# EAGLE design main (EAGLE 9.0.1)
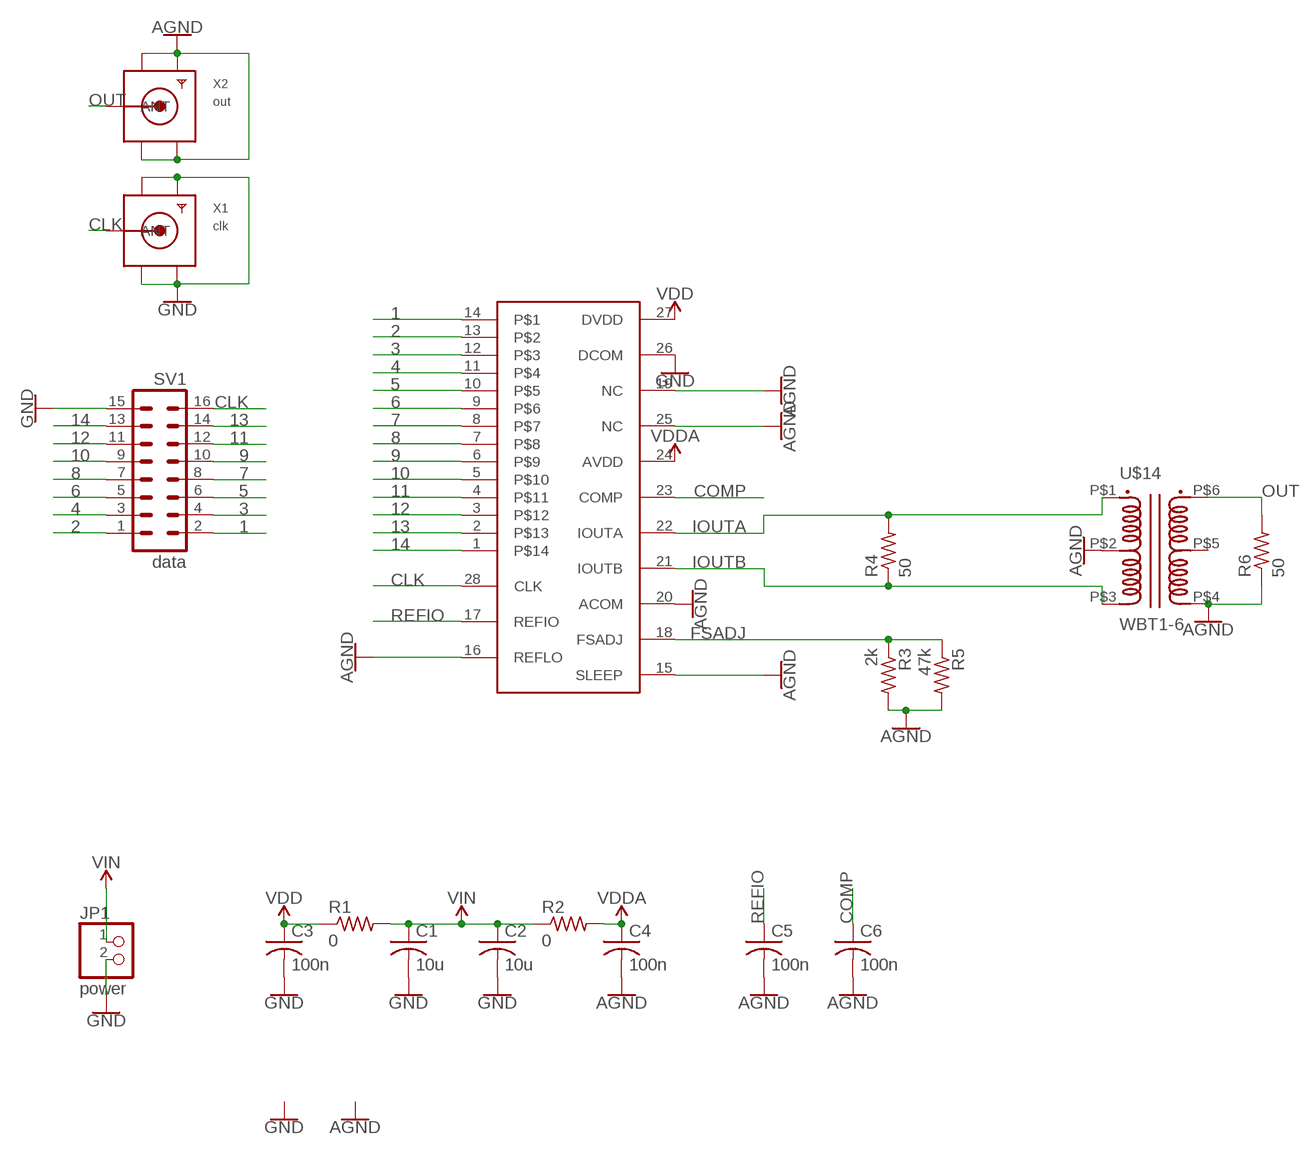
[diagram p0: schematic, sheet 1]

## Parts
C1  10u  C-USC0805K  [C0805K]
C2  10u  C-USC0805K  [C0805K]
C3  100n  C-USC0603K  [C0603K]
C4  100n  C-USC0603K  [C0603K]
C5  100n  C-USC0603K  [C0603K]
C6  100n  C-USC0603K  [C0603K]
JP1  power  PINHD-1X2  [1X02]
R1  0  R-US_0309/10  [0309/10]
R2  0  R-US_0309/10  [0309/10]
R3  2k  R-US_R0603  [R0603]
R4  50  R-US_R0603  [R0603]
R5  47k  R-US_R0603  [R0603]
R6  50  R-US_R0603  [R0603]
SV1  data  MA08-2  [MA08-2]
U$1  ISL5961  [TSSOP28]
U$14  WBT1-6  [WBT1-6]
X1  clk  SMACONNECTOR_EDGE  [SMA_EDGELAUNCH]
X2  out  SMACONNECTOR_EDGE  [SMA_EDGELAUNCH]

## Nets
1: SV1.2 U$1.14
2: SV1.1 U$1.13
3: SV1.4 U$1.12
4: SV1.3 U$1.11
5: SV1.6 U$1.10
6: SV1.5 U$1.9
7: SV1.8 U$1.8
8: SV1.7 U$1.7
9: SV1.10 U$1.6
10: SV1.9 U$1.5
11: SV1.12 U$1.4
12: SV1.11 U$1.3
13: SV1.14 U$1.2
14: SV1.13 U$1.1
AGND: C4.2 C5.2 C6.2 R3.2 R5.2 R6.1 U$1.15(SLEEP) U$1.16(REFLO) U$1.19(NC) U$1.20(ACOM) U$1.25(NC) U$14.P$2(1M) U$14.P$4(2B) X2.GND@1(GND4) X2.GND@2(GND3) X2.GND@3(GND2) X2.GND@4(GND1)
CLK: SV1.16 U$1.28(CLK) X1.P(ANT)
COMP: C6.1 U$1.23(COMP)
FSADJ: R3.1 R5.1 U$1.18(FSADJ)
GND: C1.2 C2.2 C3.2 JP1.2 SV1.15 U$1.26(DCOM) X1.GND@1(GND4) X1.GND@2(GND3) X1.GND@3(GND2) X1.GND@4(GND1)
IOUTA: R4.2 U$1.22(IOUTA) U$14.P$1(1A)
IOUTB: R4.1 U$1.21(IOUTB) U$14.P$3(1B)
OUT: R6.2 U$14.P$6(2A) X2.P(ANT)
REFIO: C5.1 U$1.17(REFIO)
VDD: C3.1 R1.1 U$1.27(DVDD)
VDDA: C4.1 R2.2 U$1.24(AVDD)
VIN: C1.1 C2.1 JP1.1 R1.2 R2.1
Unconnected: U$14.P$5(2M)

## Library data of the parts
C1-C6 = rcl:C-US: CAPACITOR, American symbol; SPICEPREFIX: C
JP1 = pinhead:PINHD-1X2: PIN HEADER
R1-R6 = rcl:R-US_: RESISTOR, American symbol; SPICEPREFIX: R
SV1 = con-lstb:MA08-2: PIN HEADER; OC_FARNELL: unknown; OC_NEWARK: unknown
U$1 = 7_segment_lib:ISL5961
U$14 = 7_segment_lib:WBT1-6
X1 X2 = adafruit:SMACONNECTOR: SMA Connector 90° DIP SMA Connector, 50 Ohm (4UConnector: 07259)

## Board
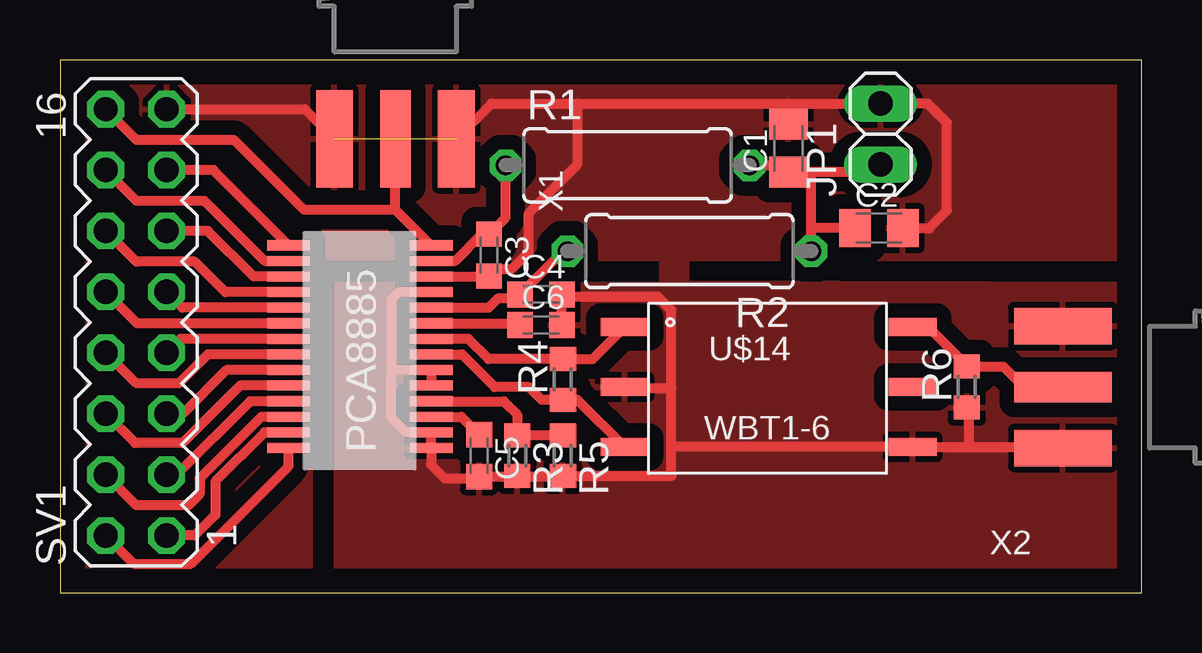
[diagram p1: board, top side]
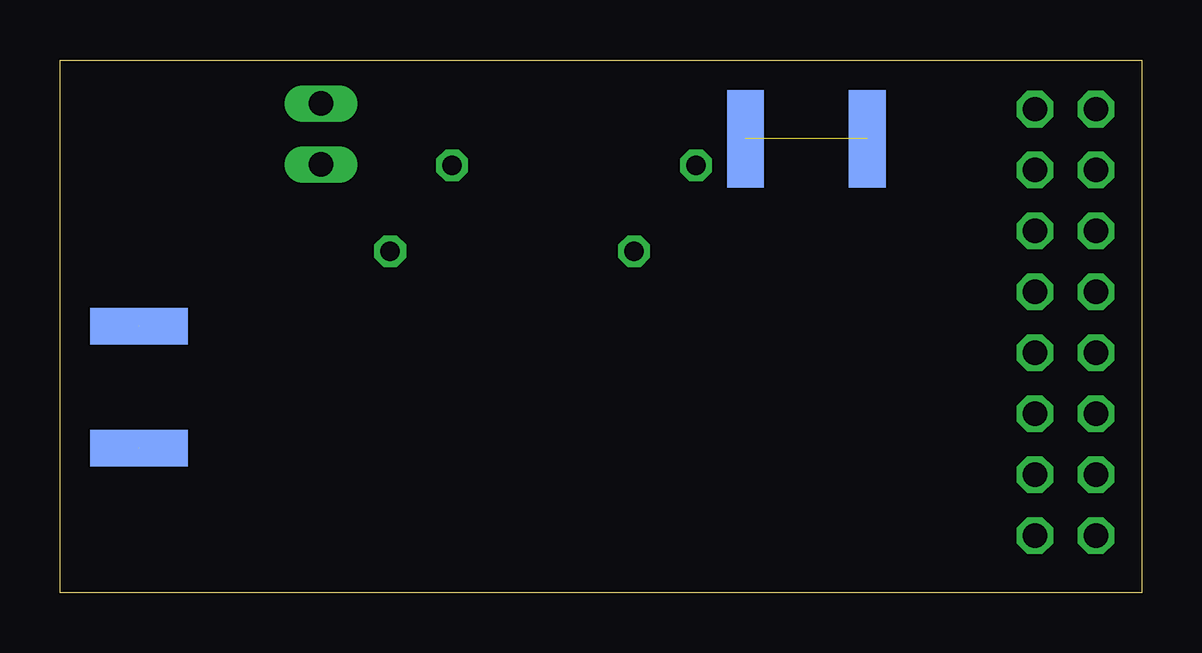
[diagram p2: board, bottom side, seen from below]

Size 45.06 x 22.21 mm. Coordinates in mm from the lower left corner, seen from the top.
Outline: 0,0 45.07,0 45.07,22.21 0,22.21 0,0
Copper layers (1*16): Top 0.035mm / dielectric 1.5mm / Bottom 0.035mm
Design rules "default": minimum track width 6mil, minimum drill 0.35mm, track to track 6mil, track to pad 6mil, pad to pad 6mil, via to via 6mil, smd to smd 6mil, copper to edge 40mil, drill to drill 6mil, minimum pad ring 10mil, minimum via ring 8mil, stop-mask expansion 4mil, vias tented up to drill 0mil, thermal gap 10mil

### Footprints (pad centres in the part's own frame; a part is rotated, then mirrored left to right if it is on the bottom)
C0805K = smd 1.3 x 1.6: 1 -1,0; 2 1,0
C0603K = smd 1.05 x 1.08: 1 -0.875,0; 2 0.875,0
1X02 = drill 1.016 long: 1 -1.27,0; 2 1.27,0
0309/10 = drill 0.813 octagon: 1 -5.08,0; 2 5.08,0
R0603 = smd 1 x 1.1: 1 -0.85,0; 2 0.85,0
MA08-2 = drill 1.016 octagon: 1 -8.89,-1.27; 2 -8.89,1.27; 3 -6.35,-1.27; 4 -6.35,1.27; 5 -3.81,-1.27; 6 -3.81,1.27; 7 -1.27,-1.27; 8 -1.27,1.27; 9 1.27,-1.27; 10 1.27,1.27; 11 3.81,-1.27; 12 3.81,1.27; 13 6.35,-1.27; 14 6.35,1.27; 15 8.89,-1.27; 16 8.89,1.27
TSSOP28 = smd 1.78 x 0.42: 1 0,8.45; 2 0,7.8; 3 0,7.15; 4 0,6.5; 5 0,5.85; 6 0,5.2; 7 0,4.55; 8 0,3.9; 9 0,3.25; 10 0,2.6; 11 0,1.95; 12 0,1.3; 13 0,0.65; 14 0,0; 15 5.94,0; 16 5.94,0.65; 17 5.94,1.3; 18 5.94,1.95; 19 5.94,2.6; 20 5.94,3.25; 21 5.94,3.9; 22 5.94,4.55; 23 5.94,5.2; 24 5.94,5.85; 25 5.94,6.5; 26 5.94,7.15; 27 5.94,7.8; 28 5.94,8.45
WBT1-6 = smd 2 x 0.76: P$1 -6,2.5; P$2 -6,0; P$3 -6,-2.5; P$4 6,-2.5; P$5 6,0; P$6 6,2.5
SMA_EDGELAUNCH = smd 4.064 x 1.524: GND@1 2.032,-2.54; GND@2 2.032,2.54 | smd 4.064 x 1.524 bottom: GND@3 2.032,2.54; GND@4 2.032,-2.54 | smd 4.064 x 1.27: P 2.032,0

### Placement (x,y rotation side)
C1  30.35,18.53 90 top
C2  34.12,15.2 0 top
C3  17.88,14.08 270 top
C4  20.04,12.44 0 top
C5  17.46,5.71 270 top
C6  20.04,11.16 0 top
JP1  34.19,19.13 90 top
R1  23.65,17.82 0 top
R2  26.23,14.24 180 top
R3  19.05,5.71 270 top
R4  20.96,8.89 90 top
R5  20.96,5.71 270 top
R6  37.78,8.57 90 top
SV1  3.17,11.27 90 top
U$1  9.52,6.03 0 top
U$14  29.53,8.57 0 top
X1  13.97,20.95 270 top
X2  43.81,8.57 180 top

### Tracks (layer width: path | path; a pad name or v marks a point on that pad's centre or on a via)
1
  Top 0.406: SV1.2 3.08,1.21 5.46,1.21 9.53,5.27 U$1.14
2
  Top 0.406: U$1.13 8.53,6.68 6.48,4.63 6.48,3.24 5.62,2.38 SV1.1
3
  Top 0.406: U$1.12 8.39,7.33 5.82,4.76 5.82,4.1 5.36,3.64 3.18,3.64 SV1.4
4
  Top 0.406: U$1.11 7.92,7.98 4.86,4.92 SV1.3
5
  Top 0.406: U$1.10 7.5,8.63 5.11,6.24 3.13,6.24 SV1.6
6
  Top 0.406: U$1.9 6.93,9.28 5.11,7.45 SV1.5
7
  Top 0.406: U$1.8 6.16,9.93 4.95,8.72 3.18,8.72 SV1.8
8
  Top 0.406: U$1.7 5.03,10.58 SV1.7
9
  Top 0.406: U$1.6 3.21,11.23 SV1.10
10
  Top 0.406: U$1.5 5.1,11.88 SV1.9
11
  Top 0.406: U$1.4 6.89,12.53 5.61,13.8 3.18,13.8 SV1.12
12
  Top 0.406: U$1.3 8.06,13.18 6.17,15.08 SV1.11
13
  Top 0.406: SV1.14 3.18,16.34 6.02,16.34 8.53,13.83 U$1.2
14
  Top 0.406: U$1.1 6.39,17.62 SV1.13
AGND  (2 unrouted)
  Top 0.406: 19.05,4.84 C5.2 17.39,4.76 16.03,4.76 15.47,5.33 U$1.15 U$1.16 14.43,6.68 13.81,7.3 13.81,9.21 | 19.05,4.84 20.93,4.84 R5.2 25.48,4.86 25.48,6.07 | R3.2 19.05,4.84 | U$1.25 14.12,12.53 13.81,12.22 13.81,9.21 | U$1.19 U$1.20 13.89,9.28 13.81,9.21 | 25.48,6.07 25.48,8.52 | 25.48,8.52 23.53,8.52 U$14.P$2 | 25.48,6.07 U$14.P$4 37.87,6.07 | 37.87,6.07 41.78,6.07 X2.GND@3 | R6.1 37.87,7.72 37.87,6.07 | C6.2 C4.2 21.02,12.33 24.92,12.33 25.48,11.77 25.48,8.52
  pour Top (isolate 0.61): 11.46,12.94 25.02,12.94 25.02,14.06 26.19,14.06 26.19,12.99 45.09,12.94 45.03,-0.62 11.46,-0.62
CLK
  Top 0.406: U$1.28 13.97,15.98 | 13.97,15.98 X1.P | SV1.16 3.18,18.88 7.24,18.88 10.15,15.98 13.97,15.98
COMP
  Top 0.406: U$1.23 19.1,11.23 C6.1
FSADJ
  Top 0.406: U$1.18 18.5,7.98 19.05,7.43 R3.1 R5.1
GND  (3 unrouted)
  Top 0.406: U$1.26 17.85,13.18 C3.2 18.17,13.5 18.82,13.5 19.53,14.21 19.53,15.84 21.56,17.87 21.56,20.4 | X1.GND@3 17.98,20.4 21.56,20.4 | 21.56,20.4 30.3,20.4 | 30.3,20.4 JP1.2 36.13,20.4 36.14,20.41 36.96,19.6 36.96,15.94 36.22,15.2 C2.2 | C1.2 30.25,20.35 30.3,20.4 | SV1.15 10.19,20.16 X1.GND@4
  pour Top (isolate 0.61): 0.03,22.19 45.09,22.19 45.09,13.86 10.49,13.86 10.49,-0.62 0.03,-0.62
IOUTA
  Top 0.406: U$1.22 17.01,10.58 17.86,9.74 R4.2 22.2,9.74 U$14.P$1
IOUTB
  Top 0.406: U$1.21 16.75,9.93 18.11,8.57 19.53,8.57 20.07,8.04 R4.1 21.56,8.04 U$14.P$3
OUT
  Top 0.406: R6.2 37.82,9.42 | 37.82,9.42 39.31,9.42 40.16,8.57 X2.P | U$14.P$6 36.17,11.07 37.82,9.42
REFIO
  Top 0.406: U$1.17 16.72,7.33 C5.1
VDD
  Top 0.406: U$1.27 16.46,13.83 17.58,14.95 C3.1 18.57,15.64 R1.1
VDDA
  Top 0.406: U$1.24 17.86,11.88 18.26,12.28 19.01,12.28 C4.1 20.96,14.24 R2.2
VIN
  Top 0.406: R1.2 30.06,17.82 C1.1 31.27,17.53 | JP1.1 33.86,17.53 31.27,17.53 | R2.1 31.31,15.23 | 31.31,15.23 31.31,17.49 31.27,17.53 | C2.1 31.33,15.2 31.31,15.23